# EAGLE design nfc-interface (EAGLE 7.5.0)
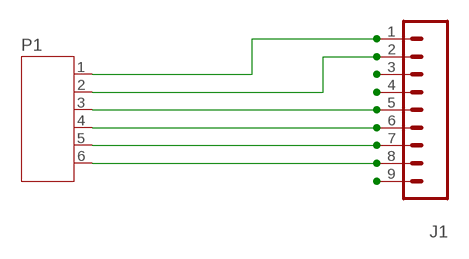
[diagram p0: schematic, sheet 1]

## Parts
J1  M09LONGPADS  [1X09_LONGPADS]
P1  JST-PH6  [JST-PH6]

## Nets
N$1: J1.8 P1.6
N$2: J1.7 P1.5
N$3: J1.6 P1.4
N$4: J1.5 P1.3
N$5: J1.1 P1.1
N$6: J1.2 P1.2
N$8: J1.3
N$9: J1.4
N$10: J1.9

## Library data of the parts
J1 = SparkFun-Connectors:M09: Header 9 Standard 9-pin 0.1" header. Use with straight break away headers (SKU : PRT-00116), right angle break away headers (PRT-00553), swiss pins (PRT-00743), machine pins (PRT-00117), and female headers (PRT-00115).
P1 = jst-ph:JST-PH6

## Board
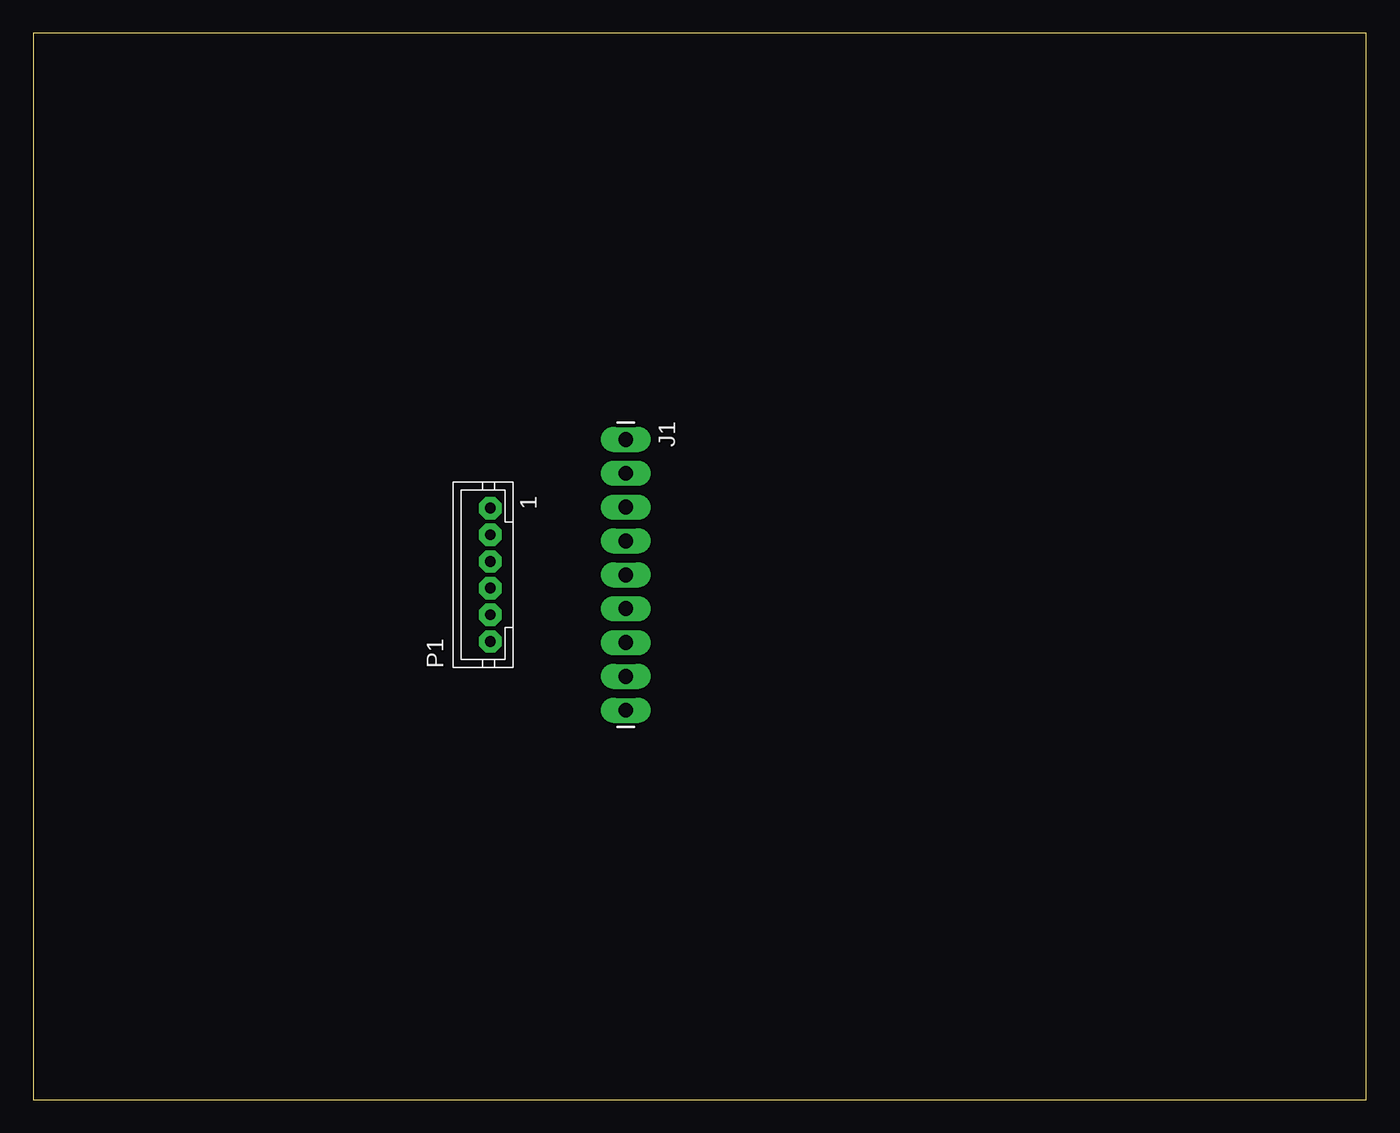
[diagram p1: board, top side]
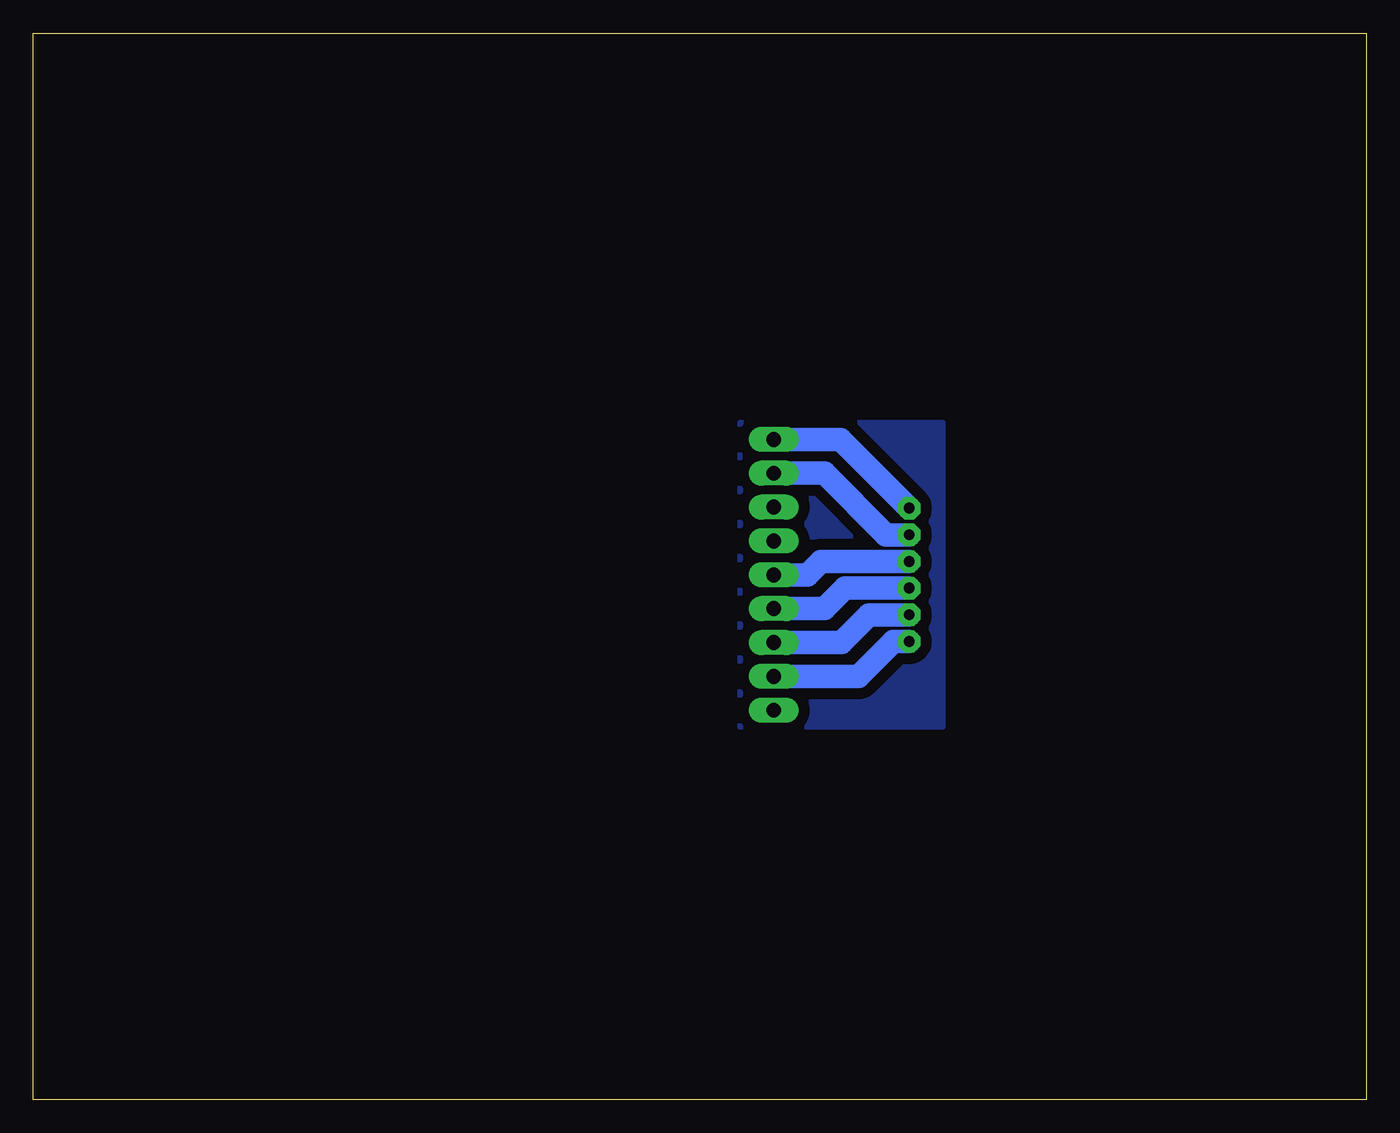
[diagram p2: board, bottom side, seen from below]

Size 100 x 80 mm. Coordinates in mm from the lower left corner, seen from the top.
Outline: 0,0 100,0 100,80 0,80 0,0
Copper layers (1*16): Top 0.035mm / dielectric 1.5mm / Bottom 0.035mm
Design rules "default": minimum track width 10mil, minimum drill 24mil, track to track 8mil, track to pad 8mil, pad to pad 8mil, via to via 8mil, smd to smd 8mil, copper to edge 40mil, drill to drill 8mil, minimum pad ring 10mil, minimum via ring 8mil, stop-mask expansion 4mil, vias tented up to drill 0mil, thermal gap 10mil

### Footprints (pad centres in the part's own frame; a part is rotated, then mirrored left to right if it is on the bottom)
1X09_LONGPADS = drill 1.118 pad 1.88 long: 1 0,0; 2 2.54,0; 3 5.08,0; 4 7.62,0; 5 10.16,0; 6 12.7,0; 7 15.24,0; 8 17.78,0; 9 20.32,0
JST-PH6 = drill 0.813 pad 1.676 octagon: 1 5,0; 2 3,0; 3 1,0; 4 -1,0; 5 -3,0; 6 -5,0

### Placement (x,y rotation side)
J1  44.45,49.53 270 top
P1  34.29,39.37 90 top

### Tracks (layer width: path | path; a pad name or v marks a point on that pad's centre or on a via)
N$1
  Bottom 1.778: P1.6 35.48,34.37 38.1,31.75 J1.8
N$2
  Bottom 1.778: P1.5 37.29,36.37 39.37,34.29 J1.7
N$3
  Bottom 1.778: P1.4 39.1,38.37 40.64,36.83 J1.6
N$4
  Bottom 1.778: P1.3 40.91,40.37 41.91,39.37 J1.5
N$5
  Bottom 1.778: P1.1 39.45,49.53 J1.1
N$6
  Bottom 1.778: P1.2 36.02,42.37 40.64,46.99 J1.2
N$7
  pour Bottom (isolate 0.813): 46.99,50.8 31.75,50.8 31.75,27.94 46.99,27.94